# Altium project PCB_Project.PrjPcb
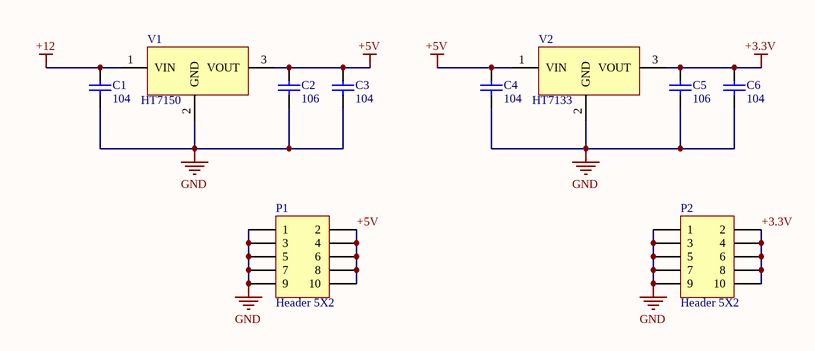
[diagram p0: Sheet2.SchDoc]
1 sheet, 10 parts. Net scope: global (net labels, ports and power ports of the same name join across sheets).
Board file: PCB2.PcbDoc

## Sheet Sheet2.SchDoc
size A4

### Parts
C1  104  [C 0805_M]
C2  106  [C 0805_M]
C3  104  [C 0805_M]
C4  104  [C 0805_M]
C5  106  [C 0805_M]
C6  104  [C 0805_M]
P1  Header 5X2  [HDR2.54-LI-2x5P]
P2  Header 5X2  [HDR2.54-LI-2x5P]
V1  HT7150  [TO220A]
V2  HT7133  [TO220A]

### Nets
+3.3V: C5.1 C6.1 P2.2 P2.4 P2.6 P2.8 P2.10 V2.3(VOUT)
+5V: C2.1 C3.1 C4.1 P1.2 P1.4 P1.6 P1.8 P1.10 V1.3(VOUT) V2.1(VIN)
+12: C1.1 V1.1(VIN)
GND: C1.2 C2.2 C3.2 C4.2 C5.2 C6.2 P1.1 P1.3 P1.5 P1.7 P1.9 P2.1 P2.3 P2.5 P2.7 P2.9 V1.2(GND) V2.2(GND)

### Library data of the parts
C1 C3 C4 C6 = Cap: Capacitor; Published: 8-Jun-2000; LatestRevisionDate: 17-Jul-2002; LatestRevisionNote: Re-released for DXP Platform.; Publisher: Altium Limited; Value: 104
C2 C5 = Cap: Capacitor; Value: 104; Published: 8-Jun-2000; LatestRevisionDate: 17-Jul-2002; LatestRevisionNote: Re-released for DXP Platform.; Publisher: Altium Limited
P1 P2 = Header 5X2: Header, 5-Pin, Dual row; LatestRevisionDate: 17-Jul-2002; LatestRevisionNote: Re-released for DXP Platform.; Publisher: Altium Limited
V1 V2 = 78xx: 线性稳压芯片; 版权归属: 源创客; BOM名称: 线性稳压芯片; 学习资源: www.ooocke.com